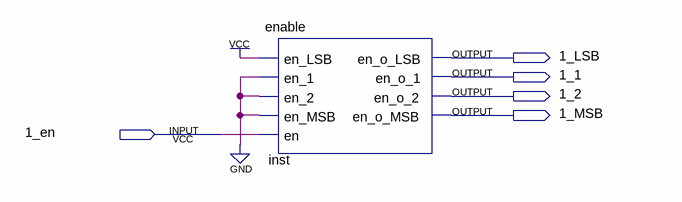
[diagram p0: schematic sheet]
// Quartus schematic 1_en.bdf as structural Verilog: 1 symbols, 5 pins
module \1_en  (
  input  \1_en ,
  output \1_LSB ,
  output \1_1 ,
  output \1_2 ,
  output \1_MSB 
);

  enable inst (
    .en_LSB(1'b1), .en_1(1'b0), .en_2(1'b0), .en_MSB(1'b0), .en(\1_en ), .en_o_LSB(\1_LSB ), .en_o_1(\1_1 ),
    .en_o_2(\1_2 ), .en_o_MSB(\1_MSB ));
endmodule
